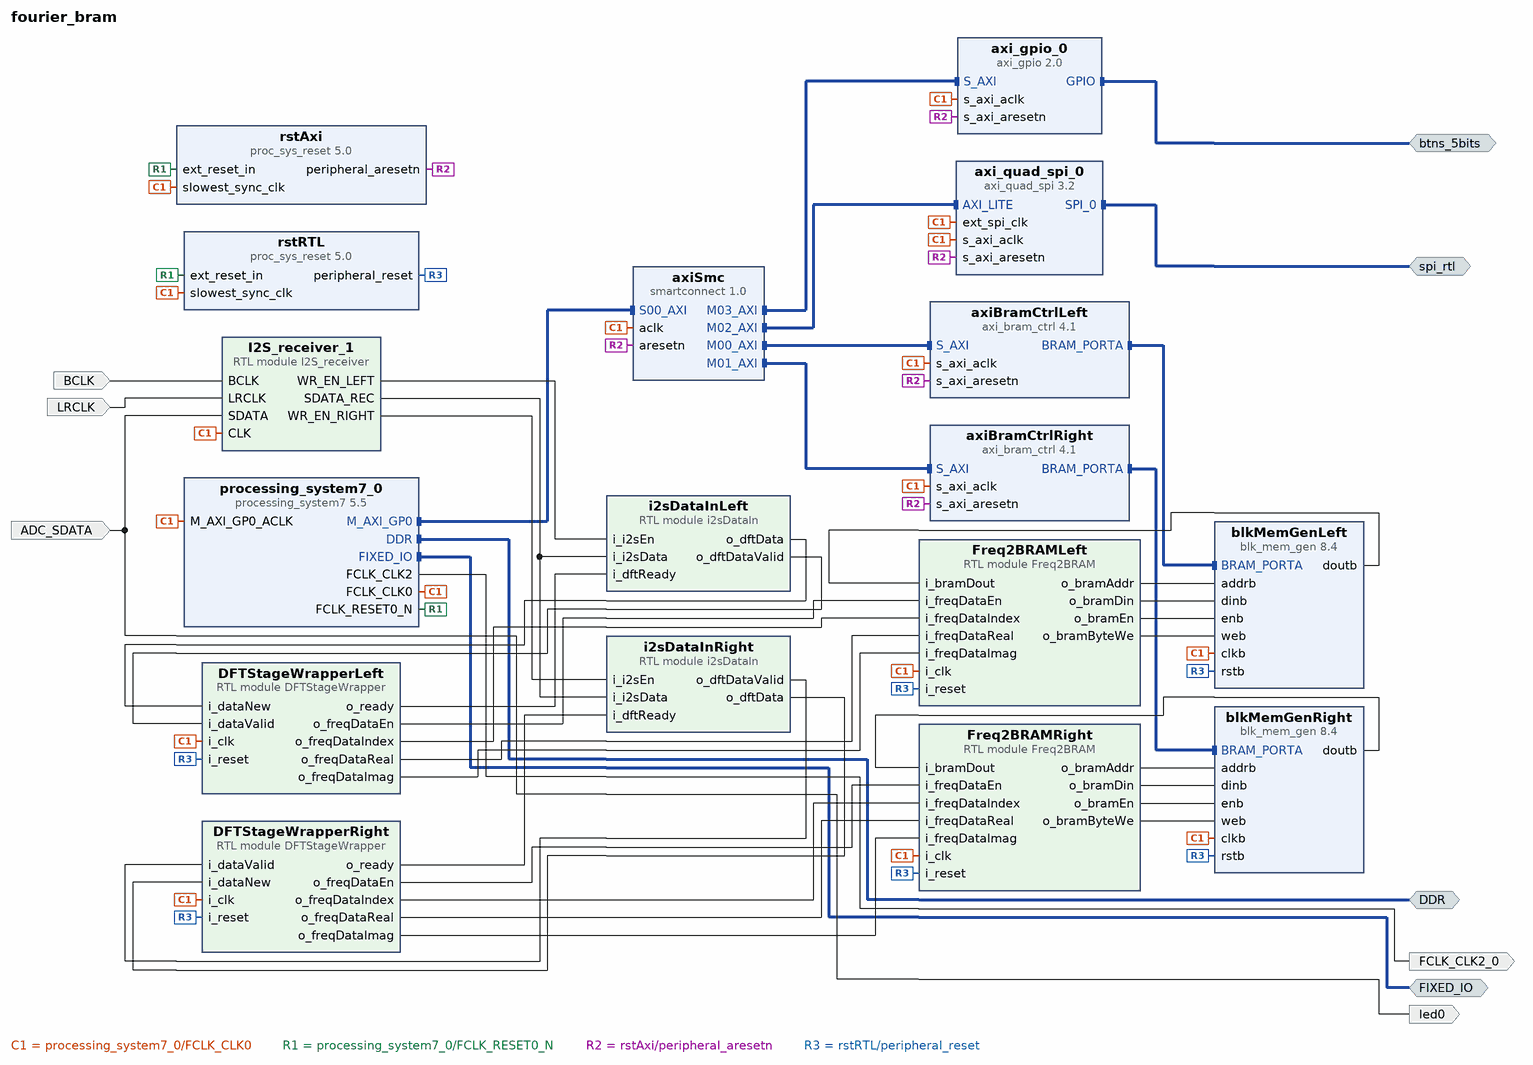
[diagram p0: block diagram of the top level]
# Vivado block design fourier_bram, xc7z020clg484-1, Vivado 2018.3
create_bd_design fourier_bram

create_bd_intf_port -mode Master -vlnv xilinx.com:interface:ddrx_rtl:1.0 DDR
create_bd_intf_port -mode Master -vlnv xilinx.com:display_processing_system7:fixedio_rtl:1.0 FIXED_IO
create_bd_intf_port -mode Master -vlnv xilinx.com:interface:spi_rtl:1.0 spi_rtl
create_bd_intf_port -mode Master -vlnv xilinx.com:interface:gpio_rtl:1.0 btns_5bits
create_bd_port -dir I LRCLK
create_bd_port -dir I BCLK
create_bd_port -dir I ADC_SDATA
create_bd_port -dir O -type clk FCLK_CLK2_0
set_property -dict {CONFIG.FREQ_HZ 10000000} [get_bd_ports FCLK_CLK2_0]
create_bd_port -dir O led0

create_bd_cell -type ip -vlnv xilinx.com:ip:processing_system7:5.5 processing_system7_0
set_property -dict [list \
  CONFIG.PCW_APU_PERIPHERAL_FREQMHZ 666.666667 \
  CONFIG.PCW_ENET0_ENET0_IO {MIO 16 .. 27} \
  CONFIG.PCW_ENET0_GRP_MDIO_ENABLE 1 \
  CONFIG.PCW_ENET0_GRP_MDIO_IO {MIO 52 .. 53} \
  CONFIG.PCW_ENET0_PERIPHERAL_ENABLE 1 \
  CONFIG.PCW_ENET0_RESET_ENABLE 0 \
  CONFIG.PCW_ENET_RESET_ENABLE 1 \
  CONFIG.PCW_ENET_RESET_SELECT {Share reset pin} \
  CONFIG.PCW_EN_CLK2_PORT 1 \
  CONFIG.PCW_FCLK_CLK2_BUF TRUE \
  CONFIG.PCW_FPGA0_PERIPHERAL_FREQMHZ 100.000000 \
  CONFIG.PCW_FPGA1_PERIPHERAL_FREQMHZ 150 \
  CONFIG.PCW_FPGA2_PERIPHERAL_FREQMHZ 10 \
  CONFIG.PCW_FPGA3_PERIPHERAL_FREQMHZ 200 \
  CONFIG.PCW_FPGA_FCLK2_ENABLE 1 \
  CONFIG.PCW_GPIO_MIO_GPIO_ENABLE 1 \
  CONFIG.PCW_GPIO_MIO_GPIO_IO MIO \
  CONFIG.PCW_I2C_RESET_ENABLE 1 \
  CONFIG.PCW_PRESET_BANK1_VOLTAGE {LVCMOS 1.8V} \
  CONFIG.PCW_QSPI_GRP_SINGLE_SS_ENABLE 1 \
  CONFIG.PCW_QSPI_GRP_SINGLE_SS_IO {MIO 1 .. 6} \
  CONFIG.PCW_QSPI_PERIPHERAL_ENABLE 1 \
  CONFIG.PCW_QSPI_QSPI_IO {MIO 1 .. 6} \
  CONFIG.PCW_SD0_GRP_CD_ENABLE 1 \
  CONFIG.PCW_SD0_GRP_CD_IO {MIO 47} \
  CONFIG.PCW_SD0_GRP_WP_ENABLE 1 \
  CONFIG.PCW_SD0_GRP_WP_IO {MIO 46} \
  CONFIG.PCW_SD0_PERIPHERAL_ENABLE 1 \
  CONFIG.PCW_SD0_SD0_IO {MIO 40 .. 45} \
  CONFIG.PCW_SDIO_PERIPHERAL_FREQMHZ 50 \
  CONFIG.PCW_SINGLE_QSPI_DATA_MODE x4 \
  CONFIG.PCW_TTC0_PERIPHERAL_ENABLE 1 \
  CONFIG.PCW_TTC0_TTC0_IO EMIO \
  CONFIG.PCW_UART1_PERIPHERAL_ENABLE 1 \
  CONFIG.PCW_UART1_UART1_IO {MIO 48 .. 49} \
  CONFIG.PCW_UART_PERIPHERAL_FREQMHZ 50 \
  CONFIG.PCW_UIPARAM_DDR_FREQ_MHZ 533.333313 \
  CONFIG.PCW_UIPARAM_DDR_PARTNO {MT41J128M16 HA-15E} \
  CONFIG.PCW_USB0_PERIPHERAL_ENABLE 1 \
  CONFIG.PCW_USB0_RESET_ENABLE 0 \
  CONFIG.PCW_USB0_USB0_IO {MIO 28 .. 39} \
  CONFIG.PCW_USB_RESET_ENABLE 1 \
  CONFIG.PCW_USB_RESET_SELECT {Share reset pin} \
  CONFIG.preset ZedBoard \
] [get_bd_cells processing_system7_0]
# 224 more settings of processing_system7_0 are not shown: defaults, MIO pin electricals, DDR timing, and values the tool derives
create_bd_cell -type ip -vlnv xilinx.com:ip:smartconnect:1.0 axiSmc
set_property -dict {CONFIG.NUM_MI 5 CONFIG.NUM_SI 1} [get_bd_cells axiSmc]
create_bd_cell -type ip -vlnv xilinx.com:ip:proc_sys_reset:5.0 rstAxi
create_bd_cell -type ip -vlnv xilinx.com:ip:proc_sys_reset:5.0 rstRTL
create_bd_cell -type ip -vlnv xilinx.com:ip:blk_mem_gen:8.4 blkMemGenRight
set_property -dict [list \
  CONFIG.EN_SAFETY_CKT false \
  CONFIG.Enable_B Use_ENB_Pin \
  CONFIG.Memory_Type True_Dual_Port_RAM \
  CONFIG.Port_B_Clock 100 \
  CONFIG.Port_B_Enable_Rate 100 \
  CONFIG.Port_B_Write_Rate 50 \
  CONFIG.Use_RSTB_Pin true \
] [get_bd_cells blkMemGenRight]
create_bd_cell -type ip -vlnv xilinx.com:ip:axi_bram_ctrl:4.1 axiBramCtrlRight
set_property -dict {CONFIG.SINGLE_PORT_BRAM 1} [get_bd_cells axiBramCtrlRight]
create_bd_cell -type ip -vlnv xilinx.com:ip:axi_quad_spi:3.2 axi_quad_spi_0
set_property -dict {CONFIG.C_FIFO_DEPTH 0 CONFIG.C_USE_STARTUP 0 CONFIG.FIFO_INCLUDED 0} [get_bd_cells axi_quad_spi_0]
create_bd_cell -type ip -vlnv xilinx.com:ip:axi_gpio:2.0 axi_gpio_0
set_property -dict {CONFIG.GPIO_BOARD_INTERFACE btns_5bits CONFIG.USE_BOARD_FLOW true} [get_bd_cells axi_gpio_0]
create_bd_cell -type module -reference I2S_receiver I2S_receiver_1
create_bd_cell -type ip -vlnv xilinx.com:ip:blk_mem_gen:8.4 blkMemGenLeft
set_property -dict [list \
  CONFIG.EN_SAFETY_CKT false \
  CONFIG.Enable_B Use_ENB_Pin \
  CONFIG.Memory_Type True_Dual_Port_RAM \
  CONFIG.Port_B_Clock 100 \
  CONFIG.Port_B_Enable_Rate 100 \
  CONFIG.Port_B_Write_Rate 50 \
  CONFIG.Use_RSTB_Pin true \
] [get_bd_cells blkMemGenLeft]
create_bd_cell -type ip -vlnv xilinx.com:ip:axi_bram_ctrl:4.1 axiBramCtrlLeft
set_property -dict {CONFIG.SINGLE_PORT_BRAM 1} [get_bd_cells axiBramCtrlLeft]
create_bd_cell -type module -reference DFTStageWrapper DFTStageWrapperLeft
create_bd_cell -type module -reference DFTStageWrapper DFTStageWrapperRight
create_bd_cell -type module -reference Freq2BRAM Freq2BRAMLeft
create_bd_cell -type module -reference Freq2BRAM Freq2BRAMRight
create_bd_cell -type module -reference i2sDataIn i2sDataInLeft
create_bd_cell -type module -reference i2sDataIn i2sDataInRight

# ---- connections ----

connect_bd_intf_net -intf_net axi_smc_M01_AXI [get_bd_intf_pins axiSmc/M01_AXI] [get_bd_intf_pins axiBramCtrlRight/S_AXI]
connect_bd_intf_net [get_bd_intf_ports DDR] [get_bd_intf_pins processing_system7_0/DDR]
connect_bd_intf_net [get_bd_intf_pins axiSmc/M00_AXI] [get_bd_intf_pins axiBramCtrlLeft/S_AXI]
connect_bd_intf_net [get_bd_intf_pins blkMemGenLeft/BRAM_PORTA] [get_bd_intf_pins axiBramCtrlLeft/BRAM_PORTA]
connect_bd_intf_net -intf_net axi_bram_ctrl_0_BRAM_PORTA1 [get_bd_intf_pins blkMemGenRight/BRAM_PORTA] [get_bd_intf_pins axiBramCtrlRight/BRAM_PORTA]
connect_bd_intf_net [get_bd_intf_ports btns_5bits] [get_bd_intf_pins axi_gpio_0/GPIO]
connect_bd_intf_net [get_bd_intf_pins axiSmc/M03_AXI] [get_bd_intf_pins axi_gpio_0/S_AXI]
connect_bd_intf_net [get_bd_intf_ports FIXED_IO] [get_bd_intf_pins processing_system7_0/FIXED_IO]
connect_bd_intf_net [get_bd_intf_pins processing_system7_0/M_AXI_GP0] [get_bd_intf_pins axiSmc/S00_AXI]
connect_bd_intf_net [get_bd_intf_pins axiSmc/M02_AXI] [get_bd_intf_pins axi_quad_spi_0/AXI_LITE]
connect_bd_intf_net [get_bd_intf_ports spi_rtl] [get_bd_intf_pins axi_quad_spi_0/SPI_0]
connect_bd_net [get_bd_pins processing_system7_0/FCLK_CLK0] \
  [get_bd_pins processing_system7_0/M_AXI_GP0_ACLK] [get_bd_pins axiSmc/aclk] [get_bd_pins rstAxi/slowest_sync_clk] \
  [get_bd_pins axiBramCtrlRight/s_axi_aclk] [get_bd_pins axi_quad_spi_0/s_axi_aclk] [get_bd_pins axi_quad_spi_0/ext_spi_clk] \
  [get_bd_pins axi_gpio_0/s_axi_aclk] [get_bd_pins rstRTL/slowest_sync_clk] [get_bd_pins blkMemGenRight/clkb] \
  [get_bd_pins I2S_receiver_1/CLK] [get_bd_pins axiBramCtrlLeft/s_axi_aclk] [get_bd_pins blkMemGenLeft/clkb] \
  [get_bd_pins DFTStageWrapperLeft/i_clk] [get_bd_pins DFTStageWrapperRight/i_clk] [get_bd_pins Freq2BRAMLeft/i_clk] \
  [get_bd_pins Freq2BRAMRight/i_clk]
connect_bd_net [get_bd_pins processing_system7_0/FCLK_RESET0_N] [get_bd_pins rstAxi/ext_reset_in] [get_bd_pins rstRTL/ext_reset_in]
connect_bd_net -net rst_ps7_0_100M_peripheral_aresetn [get_bd_pins rstAxi/peripheral_aresetn] \
  [get_bd_pins axiSmc/aresetn] [get_bd_pins axiBramCtrlRight/s_axi_aresetn] [get_bd_pins axi_quad_spi_0/s_axi_aresetn] \
  [get_bd_pins axi_gpio_0/s_axi_aresetn] [get_bd_pins axiBramCtrlLeft/s_axi_aresetn]
connect_bd_net -net proc_sys_reset_0_peripheral_reset [get_bd_pins rstRTL/peripheral_reset] \
  [get_bd_pins blkMemGenRight/rstb] [get_bd_pins blkMemGenLeft/rstb] [get_bd_pins DFTStageWrapperLeft/i_reset] \
  [get_bd_pins DFTStageWrapperRight/i_reset] [get_bd_pins Freq2BRAMLeft/i_reset] [get_bd_pins Freq2BRAMRight/i_reset]
connect_bd_net -net DFTStageWrapper_1_o_freqDataEn [get_bd_pins DFTStageWrapperRight/o_freqDataEn] [get_bd_pins Freq2BRAMRight/i_freqDataEn]
connect_bd_net -net DFTStageWrapper_1_o_freqDataIndex [get_bd_pins DFTStageWrapperRight/o_freqDataIndex] [get_bd_pins Freq2BRAMRight/i_freqDataIndex]
connect_bd_net -net DFTStageWrapper_1_o_freqDataReal [get_bd_pins DFTStageWrapperRight/o_freqDataReal] [get_bd_pins Freq2BRAMRight/i_freqDataReal]
connect_bd_net -net DFTStageWrapper_1_o_freqDataImag [get_bd_pins DFTStageWrapperRight/o_freqDataImag] [get_bd_pins Freq2BRAMRight/i_freqDataImag]
connect_bd_net -net blk_mem_gen_1_doutb [get_bd_pins blkMemGenRight/doutb] [get_bd_pins Freq2BRAMRight/i_bramDout]
connect_bd_net -net Freq2BRAM_1_o_bramAddr [get_bd_pins Freq2BRAMRight/o_bramAddr] [get_bd_pins blkMemGenRight/addrb]
connect_bd_net -net Freq2BRAM_1_o_bramDin [get_bd_pins Freq2BRAMRight/o_bramDin] [get_bd_pins blkMemGenRight/dinb]
connect_bd_net -net Freq2BRAM_1_o_bramEn [get_bd_pins Freq2BRAMRight/o_bramEn] [get_bd_pins blkMemGenRight/enb]
connect_bd_net -net Freq2BRAM_1_o_bramByteWe [get_bd_pins Freq2BRAMRight/o_bramByteWe] [get_bd_pins blkMemGenRight/web]
connect_bd_net [get_bd_ports ADC_SDATA] [get_bd_ports led0] [get_bd_pins I2S_receiver_1/SDATA]
connect_bd_net [get_bd_ports BCLK] [get_bd_pins I2S_receiver_1/BCLK]
connect_bd_net [get_bd_ports LRCLK] [get_bd_pins I2S_receiver_1/LRCLK]
connect_bd_net -net I2S_receiver_0_SDATA_REC [get_bd_pins I2S_receiver_1/SDATA_REC] \
  [get_bd_pins i2sDataInLeft/i_i2sData] [get_bd_pins i2sDataInRight/i_i2sData]
connect_bd_net -net I2S_receiver_0_WR_EN_RIGHT [get_bd_pins I2S_receiver_1/WR_EN_RIGHT] [get_bd_pins i2sDataInRight/i_i2sEn]
connect_bd_net [get_bd_pins processing_system7_0/FCLK_CLK2] [get_bd_ports FCLK_CLK2_0]
connect_bd_net [get_bd_pins DFTStageWrapperRight/o_ready] [get_bd_pins i2sDataInRight/i_dftReady]
connect_bd_net -net fifoDataInRight_o_dftDataValid [get_bd_pins i2sDataInRight/o_dftDataValid] [get_bd_pins DFTStageWrapperRight/i_dataValid]
connect_bd_net -net fifoDataInRight_o_dftData [get_bd_pins i2sDataInRight/o_dftData] [get_bd_pins DFTStageWrapperRight/i_dataNew]
connect_bd_net [get_bd_pins I2S_receiver_1/WR_EN_LEFT] [get_bd_pins i2sDataInLeft/i_i2sEn]
connect_bd_net [get_bd_pins i2sDataInLeft/o_dftData] [get_bd_pins DFTStageWrapperLeft/i_dataNew]
connect_bd_net [get_bd_pins i2sDataInLeft/o_dftDataValid] [get_bd_pins DFTStageWrapperLeft/i_dataValid]
connect_bd_net [get_bd_pins DFTStageWrapperLeft/o_ready] [get_bd_pins i2sDataInLeft/i_dftReady]
connect_bd_net [get_bd_pins DFTStageWrapperLeft/o_freqDataEn] [get_bd_pins Freq2BRAMLeft/i_freqDataEn]
connect_bd_net [get_bd_pins DFTStageWrapperLeft/o_freqDataIndex] [get_bd_pins Freq2BRAMLeft/i_freqDataIndex]
connect_bd_net [get_bd_pins DFTStageWrapperLeft/o_freqDataReal] [get_bd_pins Freq2BRAMLeft/i_freqDataReal]
connect_bd_net [get_bd_pins DFTStageWrapperLeft/o_freqDataImag] [get_bd_pins Freq2BRAMLeft/i_freqDataImag]
connect_bd_net [get_bd_pins Freq2BRAMLeft/o_bramAddr] [get_bd_pins blkMemGenLeft/addrb]
connect_bd_net [get_bd_pins Freq2BRAMLeft/o_bramDin] [get_bd_pins blkMemGenLeft/dinb]
connect_bd_net [get_bd_pins Freq2BRAMLeft/o_bramEn] [get_bd_pins blkMemGenLeft/enb]
connect_bd_net [get_bd_pins Freq2BRAMLeft/o_bramByteWe] [get_bd_pins blkMemGenLeft/web]
connect_bd_net [get_bd_pins blkMemGenLeft/doutb] [get_bd_pins Freq2BRAMLeft/i_bramDout]
set_property HDL_ATTRIBUTE.BMM_INFO_PROCESSOR {arm > fourier_bram axiBramCtrlLeft fourier_bram axiBramCtrlRight} [get_bd_cells processing_system7_0]
set_property HDL_ATTRIBUTE.KEEP_HIERARCHY yes [get_bd_cells processing_system7_0]
set_property HDL_ATTRIBUTE.BMM_INFO_ADDRESS_SPACE {byte  0x42000000 32 > fourier_bram blkMemGenRight} [get_bd_cells axiBramCtrlRight]
set_property HDL_ATTRIBUTE.KEEP_HIERARCHY yes [get_bd_cells axiBramCtrlRight]
set_property HDL_ATTRIBUTE.BMM_INFO_ADDRESS_SPACE {byte  0x40000000 32 > fourier_bram blkMemGenLeft} [get_bd_cells axiBramCtrlLeft]
set_property HDL_ATTRIBUTE.KEEP_HIERARCHY yes [get_bd_cells axiBramCtrlLeft]

# ---- address map ----
assign_bd_address -offset 0x40000000 -range 8K -target_address_space [get_bd_addr_spaces processing_system7_0/Data] [get_bd_addr_segs axiBramCtrlLeft/S_AXI/Mem0]
assign_bd_address -offset 0x41200000 -range 64K -target_address_space [get_bd_addr_spaces processing_system7_0/Data] [get_bd_addr_segs axi_gpio_0/S_AXI/Reg]
assign_bd_address -offset 0x41E00000 -range 64K -target_address_space [get_bd_addr_spaces processing_system7_0/Data] [get_bd_addr_segs axi_quad_spi_0/AXI_LITE/Reg]
assign_bd_address -offset 0x42000000 -range 8K -target_address_space [get_bd_addr_spaces processing_system7_0/Data] [get_bd_addr_segs axiBramCtrlRight/S_AXI/Mem0]

validate_bd_design
save_bd_design
